# EAGLE design ProtoShieldBasic_SKAARHOJ (EAGLE 7.5.0)
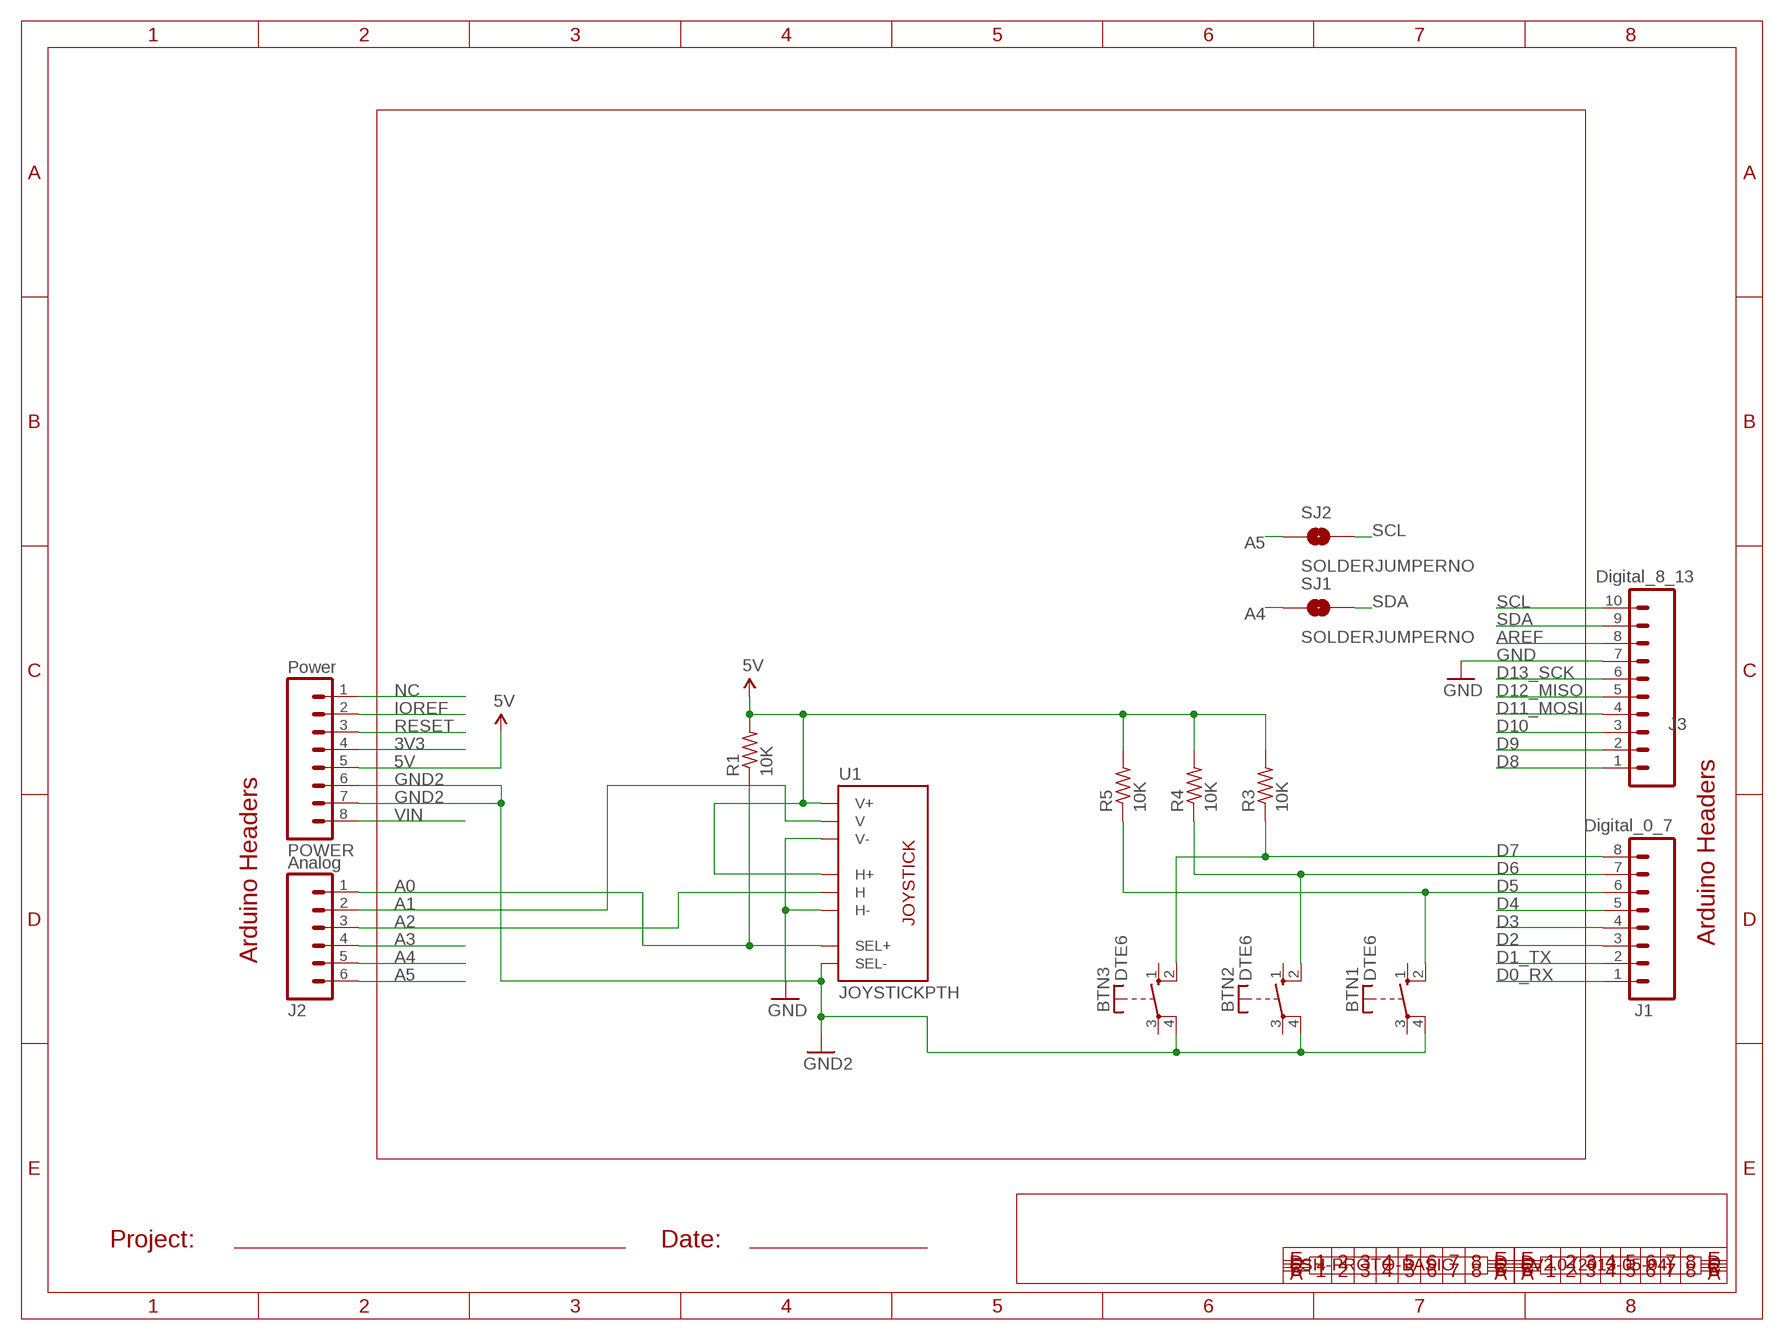
[diagram p0: schematic, sheet 1]

## Parts
BTN1  DTE6  [DTE6]
BTN2  DTE6  [DTE6]
BTN3  DTE6  [DTE6]
J1  Digital_0_7  M08  [1X08]
J2  Analog  M06SIP  [1X06]
J3  Digital_8_13  M100.1  [1X10]
POWER  Power  M08  [1X08]
R1  10K  R-US_0207/10  [0207/10]
R3  10K  R-US_0207/10  [0207/10]
R4  10K  R-US_0207/10  [0207/10]
R5  10K  R-US_0207/10  [0207/10]
SJ1  SOLDERJUMPERNO  [SJ_2S-NO]
SJ2  SOLDERJUMPERNO  [SJ_2S-NO]
U1  JOYSTICKPTH  [JOYSTICK]

## Nets
3V3: POWER.4
5V: POWER.5 R1.2 R3.2 R4.2 R5.2 U1.H1(H+) U1.V1(V+)
A0: J2.1 R1.1 U1.B1A(SEL+)
A1: J2.2 U1.V2(V)
A2: J2.3 U1.H2(H)
A3: J2.4
A4: J2.5 SJ1.1
A5: J2.6 SJ2.1
AREF: J3.8
D0_RX: J1.1
D1_TX: J1.2
D2: J1.3
D3: J1.4
D4: J1.5
D5: BTN1.2(S) J1.6 R5.1
D6: BTN2.2(S) J1.7 R4.1
D7: BTN3.2(S) J1.8 R3.1
D8: J3.1
D9: J3.2
D10: J3.3
D11_MOSI: J3.4
D12_MISO: J3.5
D13_SCK: J3.6
GND: J3.7 U1.H3(H-) U1.V3(V-)
GND2: BTN1.4(P) BTN2.4(P) BTN3.4(P) POWER.6 POWER.7 U1.B2A(SEL-)
IOREF: POWER.2
NC: POWER.1
RESET: POWER.3
SCL: J3.10 SJ2.2
SDA: J3.9 SJ1.2
VIN: POWER.8
Unconnected: BTN1.1(S) BTN1.3(P) BTN2.1(S) BTN2.3(P) BTN3.1(S) BTN3.3(P)

## Notes on the sheet
- Arduino Headers
- Arduino Headers
- Project: | Date:
- SH-PROTO-BASIC | V2.0 (2013-05-04)

## Library data of the parts
BTN1-BTN3 = switch-misc:DT: ITT SWITCH
J1 = freetronics:M08: Header 8 Standard 8-pin 0.1" header. Use with straight break away headers (SKU : PRT-00116), right angle break away headers (PRT-00553), swiss pins (PRT-00743), machine pins (PRT-00117), and female headers (PRT-00115).
J2 = freetronics:M06: Header 6 Standard 6-pin 0.1" header. Use with straight break away headers (SKU : PRT-00116), right angle break away headers (PRT-00553), swiss pins (PRT-00743), machine pins (PRT-00117), and female headers (PRT-00115). Molex polarized connector foot print use with SKU : PRT-08094 with associated crimp pins and housings. NOTES ON THE VARIANTS LOCK and LOCK_LONGPADS... This footprint was designed to help hold the alignment of a through-hole component (i.e. 6-pin header) while soldering it into place. You may notice that each hole has been shifted either up or down by 0.005 of an inch from it's more standard position (which is a perfectly straight line). This slight alteration caused the pins (the squares in the middle) to touch the edges of the holes. Because they are alternating, it causes a "brace" to hold the component in place. 0.005 has proven to be the perfect amount of "off-center" position when using our standard breakaway headers. Although looks a little odd when you look at the bare footprint, once you have a header in there, the alteration is very hard to notice. Also, if you push a header all the way into place, it is covered up entirely on the bottom side. This idea of altering the position of holes to aid alignment will be further integrated into the Sparkfun Library for other footprints. It can help hold any component with 3 or more connection pins.
J3 = freetronics-original:M10: Header 10 Standard 10-pin 0.1" header. Use with straight break away headers (SKU : PRT-00116), right angle break away headers (PRT-00553), swiss pins (PRT-00743), machine pins (PRT-00117), and female headers (PRT-00115).
POWER = freetronics-original:M08: Header 8 Standard 8-pin 0.1" header. Use with straight break away headers (SKU : PRT-00116), right angle break away headers (PRT-00553), swiss pins (PRT-00743), machine pins (PRT-00117), and female headers (PRT-00115).
R1 R3-R5 = resistor:R-US_: RESISTOR, American symbol
SJ1 SJ2 = SparkFun:SOLDERJUMPER: Solder Jumper Standard SMD solder jumper. Used to automate production. Two varients : Normally Open and Normally Closed are the same, but have different paste layers. NC will have a large amount of paste and should jumper during reflow.
U1 = SparkFun-Electromechanical:JOYSTICK: Thumb Joystick Joystick commonly found in PS2 controllers. Two pots and a select switch. Footprint proven. Spark Fun Electronics SKU : COM-09032

## Net classes
0 default: width 0.406 mm

## Board
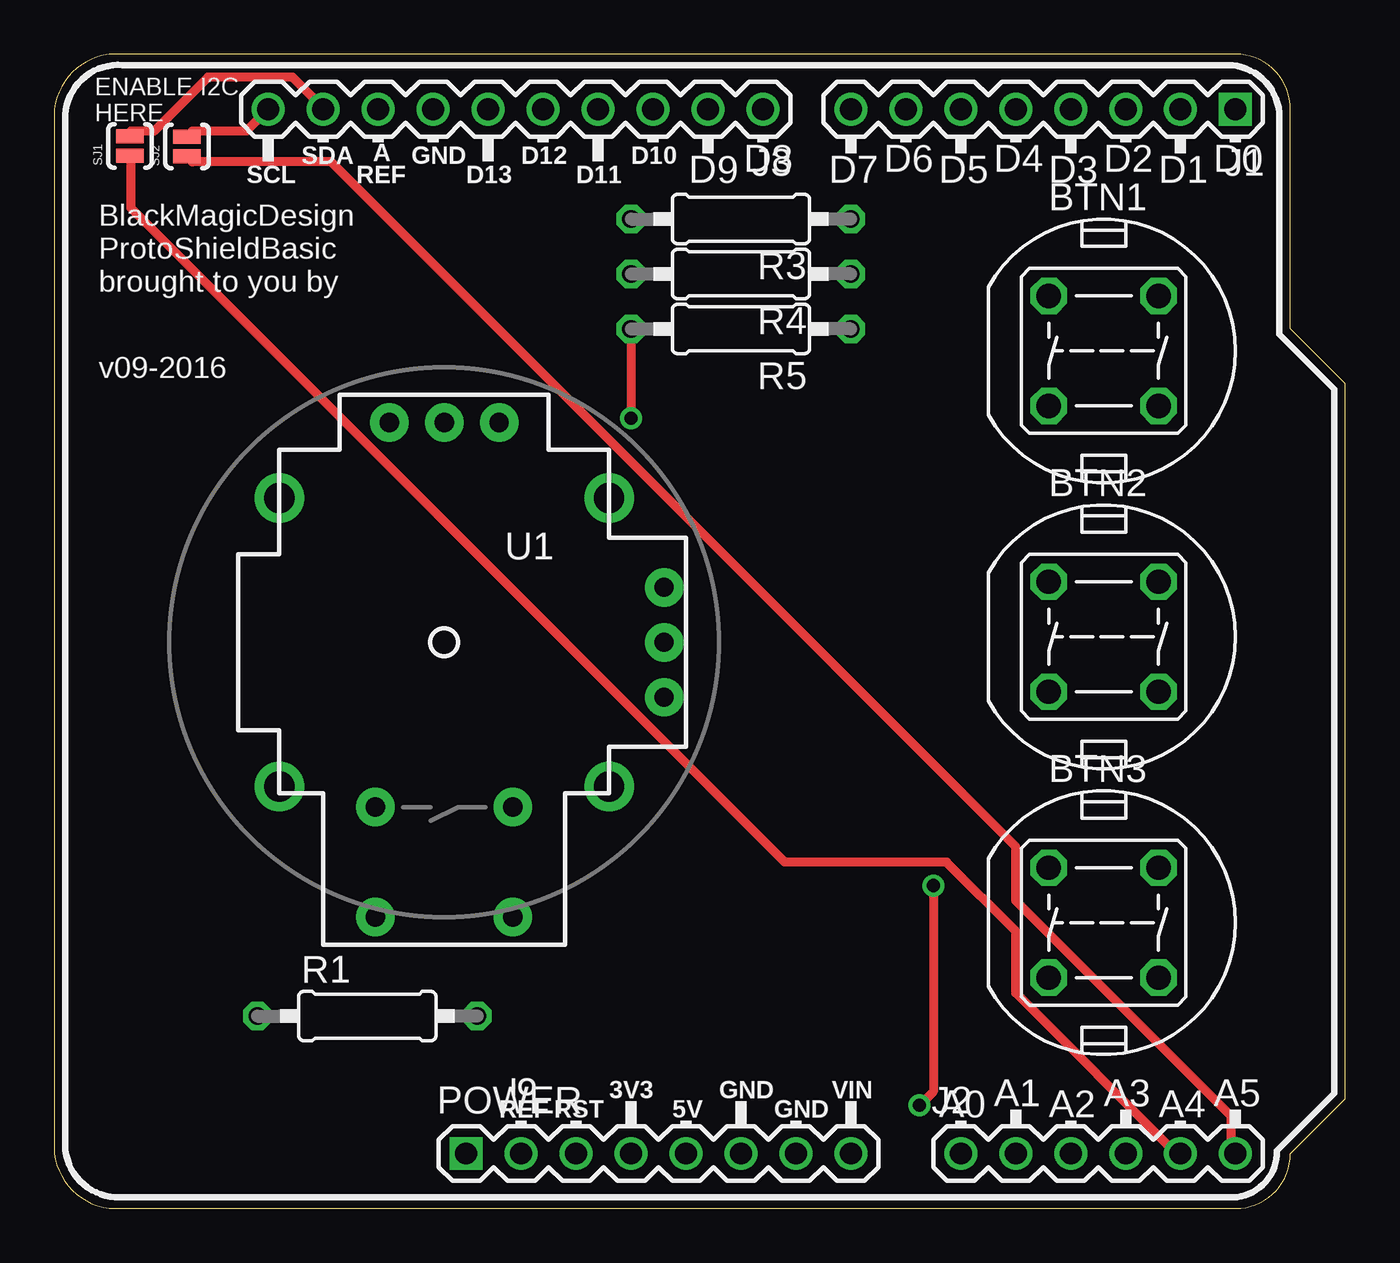
[diagram p1: board, top side]
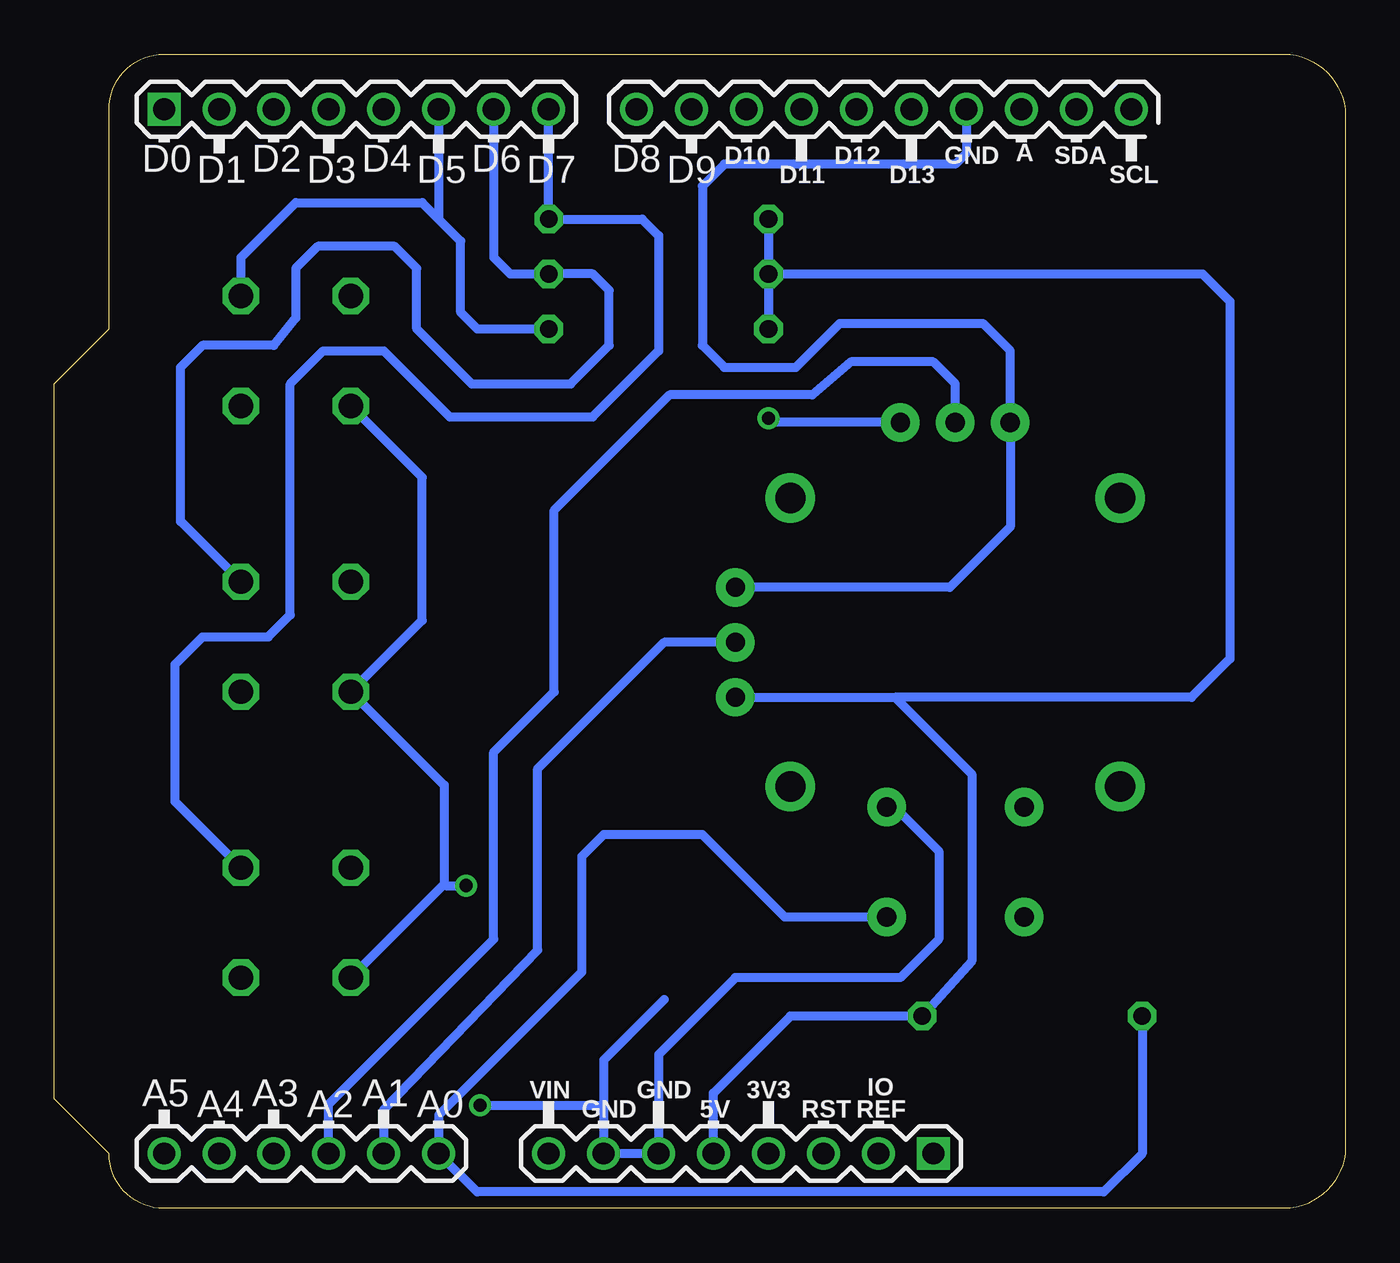
[diagram p2: board, bottom side, seen from below]

Size 59.69 x 53.34 mm. Coordinates in mm from the lower left corner, seen from the top.
Outline: 0,2.54 arc74 2.54,0 54.61,0 arc90 57.15,2.54 59.69,5.08 59.69,38.1 57.15,40.64 57.15,50.8 arc90 54.61,53.34 2.54,53.34 arc74 0,50.8 0,2.54
Copper layers (1*16): Top 0.035mm / dielectric 1.5mm / Bottom 0.035mm
Design rules "default *": minimum track width 10mil, minimum drill 24mil, track to track 12mil, track to pad 12mil, pad to pad 12mil, via to via 12mil, smd to smd 8mil, copper to edge 18mil, drill to drill 8mil, minimum pad ring 10mil, minimum via ring 8mil, stop-mask expansion 4mil, vias tented up to drill 0mil, thermal gap 10mil

### Footprints (pad centres in the part's own frame; a part is rotated, then mirrored left to right if it is on the bottom)
DTE6 = drill 1.118 octagon: 1 -2.54,2.54; 2 2.54,2.54; 3 2.54,-2.54; 4 -2.54,-2.54
1X08 = drill 1.016 square: 1 0,0 | drill 1.016: 2 2.54,0; 3 5.08,0; 4 7.62,0; 5 10.16,0; 6 12.7,0; 7 15.24,0; 8 17.78,0
1X06 = drill 1.016: 1 0,0; 2 2.54,0; 3 5.08,0; 4 7.62,0; 5 10.16,0; 6 12.7,0
1X10 = drill 1.016: 1 0,0; 2 2.54,0; 3 5.08,0; 4 7.62,0; 5 10.16,0; 6 12.7,0; 7 15.24,0; 8 17.78,0; 9 20.32,0; 10 22.86,0
0207/10 = drill 0.813 octagon: 1 -5.08,0; 2 5.08,0
SJ_2S-NO = smd 0.635 x 1.27: 1 -0.45,0; 2 0.45,0
JOYSTICK = drill 0.9 pad 1.778: B1A -3.175,12.7; B1B 3.175,12.7; B2A -3.175,7.62; B2B 3.175,7.62 | drill 0.889 pad 1.778: H1 -2.54,-10.16; H2 0,-10.16; H3 2.54,-10.16; V1 -10.16,2.54; V2 -10.16,0; V3 -10.16,-2.54 | drill 1.397 pad 2.286: MOUNT1 -7.62,6.668; MOUNT2 -7.62,-6.668; MOUNT3 7.62,-6.668; MOUNT4 7.62,6.668

### Placement (x,y rotation side)
BTN1  48.51,39.62 0 top
BTN2  48.51,26.42 0 top
BTN3  48.51,13.21 0 top
J1  54.61,50.8 180 top
J2  41.91,2.54 0 top
J3  32.77,50.8 180 top
POWER  19.05,2.54 0 top
R1  14.48,8.89 0 top
R3  31.75,45.72 180 top
R4  31.75,43.18 180 top
R5  31.75,40.64 180 top
SJ1  3.51,49.1 90 top
SJ2  6.15,49.07 90 top
U1  18.03,26.16 180 top

### Tracks (layer width: path | path; a pad name or v marks a point on that pad's centre or on a via)
5V  (via drill 0.61)
  Top 0.406: R5.2 v26.67,36.51
  Bottom 0.406: POWER.5 29.21,5.33 25.65,8.89 R1.2 17.27,11.43 17.27,20.07 20.83,23.62 | U1.V1 20.83,23.62 | R3.2 R4.2 | R4.2 R5.2 | R4.2 6.6,43.18 5.33,41.91 5.33,25.4 7.11,23.62 20.83,23.62 | U1.H1 26.67,36.32 v26.67,36.51
A0
  Bottom 0.406: R1.1 9.4,2.54 11.18,0.76 40.13,0.76 J2.1 41.91,4.32 35.31,10.92 35.31,16.26 34.29,17.27 29.72,17.27 25.91,13.46 U1.B1A
A1
  Bottom 0.406: J2.2 44.45,4.57 37.34,11.94 37.34,20.32 31.5,26.16 U1.V2
A2
  Bottom 0.406: U1.H2 18.03,38.1 19.05,39.12 22.86,39.12 24.64,37.59 31.24,37.59 36.58,32.26 36.58,23.88 39.37,21.08 39.37,12.45 46.99,4.83 J2.3
A4
  Top 0.406: SJ1.1 3.56,48.36 3.56,46.23 33.78,16 41.25,16 44.45,12.8 44.45,9.96 51.92,2.49 J2.5
A5
  Top 0.406: SJ2.1 6.4,48.36 12.8,48.36 44.45,16.71 44.45,14.22 54.41,4.27 54.41,2.85 J2.6
D5
  Bottom 0.406: J1.6 41.91,45.72 | R5.1 40.13,40.64 40.89,41.4 40.89,44.7 41.91,45.72 | BTN1.2 51.05,43.94 48.51,46.48 42.67,46.48 41.91,45.72
D6
  Bottom 0.406: J1.7 39.37,43.94 38.61,43.18 R4.1 34.8,43.18 34.04,42.42 34.04,39.88 35.81,38.1 40.39,38.1 42.93,40.64 42.93,43.43 43.94,44.45 47.5,44.45 48.51,43.43 48.51,41.15 49.53,39.88 52.83,39.88 53.85,38.86 53.85,31.75 BTN2.2
D7
  Bottom 0.406: J1.8 R3.1 32.51,45.72 31.75,44.96 31.75,39.62 34.8,36.58 41.4,36.58 44.45,39.62 47.24,39.62 48.77,38.1 48.77,27.43 49.78,26.42 52.83,26.42 54.1,25.15 54.1,18.8 BTN3.2
GND
  Bottom 0.406: U1.V3 18.29,28.7 15.49,31.5 U1.H3 15.49,39.62 16.76,40.89 23.37,40.89 25.4,38.86 28.7,38.86 29.72,39.88 29.72,47.24 28.7,48.26 18.03,48.26 17.53,48.77 J3.7
GND2  (via drill 0.61)
  Top 0.406: v40.01,4.76 40.64,5.4 v40.64,14.92
  Bottom 0.406: 31.5,9.65 34.29,6.86 34.29,4.76 | 34.29,4.76 POWER.7 POWER.6 31.75,7.11 28.19,10.67 20.57,10.67 18.8,12.45 18.8,16.51 20.83,18.54 20.95,18.41 U1.B2A | 41.66,14.99 BTN3.4 | BTN1.4 42.67,33.78 42.67,27.18 BTN2.4 41.66,19.56 41.66,14.99 | v40.01,4.76 34.29,4.76 | v40.64,14.92 41.59,14.92 41.66,14.99
SCL
  Top 0.406: J3.10 8.89,49.78 6.4,49.78 SJ2.2
SDA
  Top 0.406: SJ1.2 3.56,49.78 4.62,49.78 7.11,52.27 11.02,52.27 12.45,50.85 J3.9

### Text on the board
tPlace: SDA | A | GND | D12 | D10 | D8 | D6 | D4 | D2 | D0 | SCL | REF | D13 | D11 | D9 | D7 | D5 | D3 | D1 | IO | 3V3 | GND | VIN | A1 | A3 | A5 | REF | RST | 5V | GND | A0 | A2 | A4
bPlace: SDA | A | GND | D12 | D10 | D8 | D6 | D4 | D2 | D0 | SCL | D13 | D11 | D9 | D7 | D5 | D3 | D1 | IO | 3V3 | GND | VIN | A1 | A3 | A5 | REF | RST | 5V | GND | A0 | A2 | A4
_tsilk: ENABLE I2C / HERE | BlackMagicDesign / ProtoShieldBasic / brought to you by | v09-2016